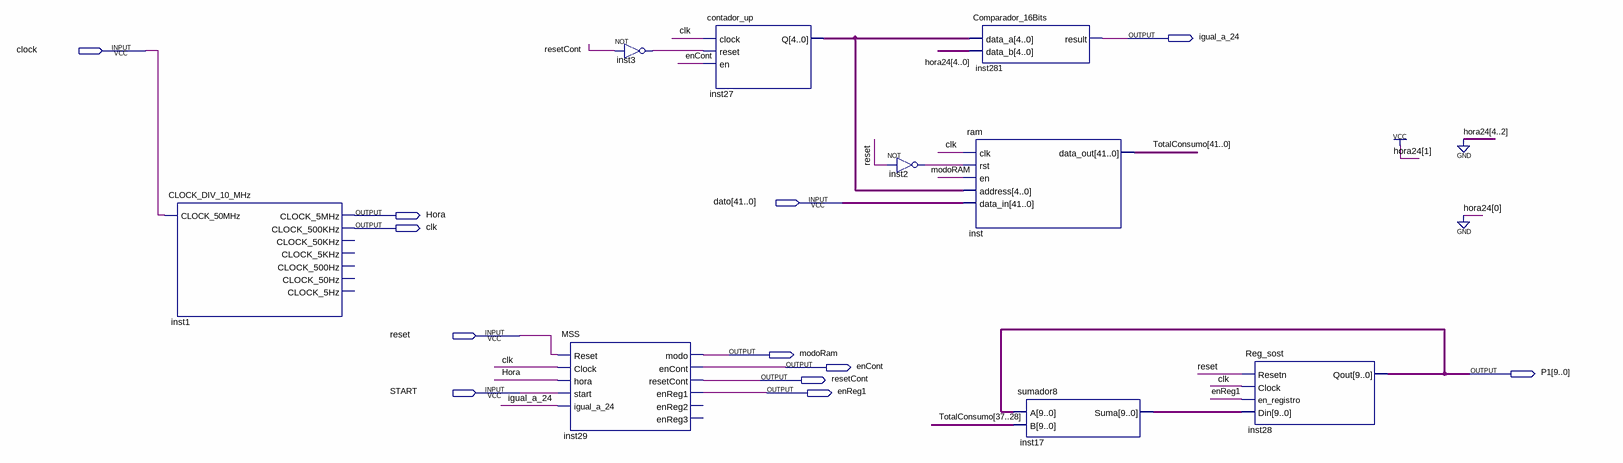
[diagram p0: schematic sheet]
// Quartus schematic Block5.bdf as structural Verilog: 9 symbols, 12 pins
module Block5 (
  input  clock,
  input  [41:0] dato,
  input  reset,
  input  START,
  output igual_a_24,
  output Hora,
  output clk,
  output modoRam,
  output enCont,
  output [9:0] P1,
  output resetCont,
  output enReg1
);

  wire inst2_out, inst3_out;
  wire [4:0] inst27_q;
  wire [9:0] inst17_suma;
  wire [41:0] TotalConsumo;

  CLOCK_DIV_10_MHz inst1 (
    .CLOCK_50MHz(clock), .CLOCK_5MHz(Hora), .CLOCK_500KHz(clk));  // open: CLOCK_50KHz, CLOCK_5KHz, CLOCK_500Hz, CLOCK_50Hz, CLOCK_5Hz
  MSS inst29 (
    .Reset(reset), .Clock(clk), .hora(Hora), .start(START), .igual_a_24(igual_a_24), .modo(modoRam),
    .enCont(enCont), .resetCont(resetCont), .enReg1(enReg1));  // open: enReg2, enReg3
  not inst3 (inst3_out, resetCont);
  contador_up inst27 (.clock(clk), .reset(inst3_out), .en(enCont), .Q(inst27_q));
  not inst2 (inst2_out, reset);
  Comparador_16Bits inst281 (.data_a(inst27_q), .data_b(5'b00010), .result(igual_a_24));
  ram inst (.clk(clk), .rst(inst2_out), .en(modoRam), .address(inst27_q), .data_in(dato), .data_out(TotalConsumo));
  sumador8 inst17 (.A(P1), .B(TotalConsumo[37:28]), .Suma(inst17_suma));
  Reg_sost inst28 (.Resetn(reset), .Clock(clk), .en_registro(enReg1), .Din(inst17_suma), .Qout(P1));
endmodule
